# Altium schematic sheet LightLinkV2.SchDoc
size A4; SheetNumber: 1; SheetTotal: 4
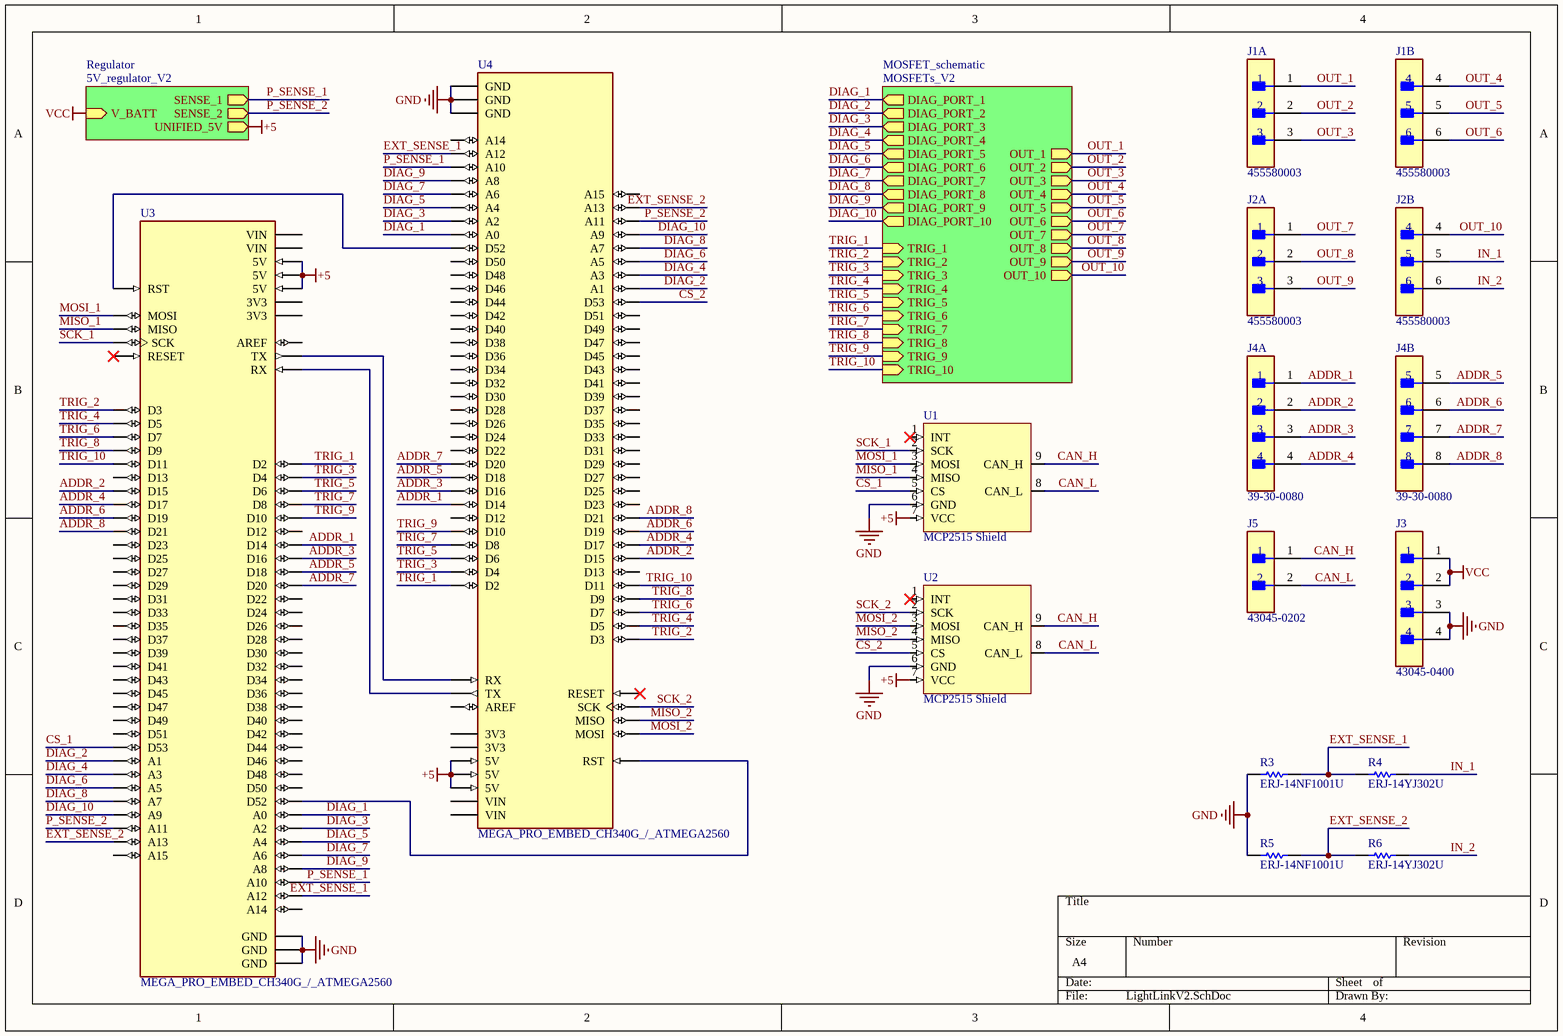
[diagram p0: LightLinkV2.SchDoc]

## Parts
J1  455580003  [FP-455580003-MFG]  (parts A,B of 2)
J2  455580003  [FP-455580003-MFG]  (parts A,B of 2)
J3  43045-0400  [FP-43045-0400-MFG]
J4  39-30-0080  [FP-39-30-0080-MFG]  (parts A,B of 2)
J5  43045-0202  [FP-43045-0202-MFG]
R3  ERJ-14NF1001U  [RESC3225X70X50NL20T20]
R4  ERJ-14YJ302U  [RESC3225X70X50NL20T20]
R5  ERJ-14NF1001U  [RESC3225X70X50NL20T20]
R6  ERJ-14YJ302U  [RESC3225X70X50NL20T20]
U1  MCP2515 Shield  [MCP2515 Shield-Footprint-1]
U2  MCP2515 Shield  [MCP2515 Shield-Footprint-1]
U3  MEGA_PRO_EMBED_CH340G_/_ATMEGA2560  [MODULE_MEGA_PRO_EMBED_CH340G_/_ATMEGA2560]
U4  MEGA_PRO_EMBED_CH340G_/_ATMEGA2560  [MODULE_MEGA_PRO_EMBED_CH340G_/_ATMEGA2560]

## Sub-sheets
MOSFET_schematic = MOSFETs_V2: DIAG_PORT_1 (out), TRIG_1 (in), DIAG_PORT_2 (out), TRIG_2 (in), DIAG_PORT_3 (out), TRIG_3 (in), DIAG_PORT_4 (out), TRIG_4 (in), OUT_4 (out), OUT_3 (out), OUT_2 (out), OUT_1 (out), DIAG_PORT_5 (out), TRIG_5 (in), DIAG_PORT_6 (out), TRIG_6 (in), DIAG_PORT_7 (out), TRIG_7 (in), DIAG_PORT_8 (out), TRIG_8 (in), OUT_8 (out), OUT_7 (out), OUT_6 (out), OUT_5 (out), DIAG_PORT_9 (out), TRIG_9 (in), OUT_9 (out), DIAG_PORT_10 (out), TRIG_10 (in), OUT_10 (out)
Regulator = 5V_regulator_V2: UNIFIED_5V (out), V_BATT (in), SENSE_1 (out), SENSE_2 (out)

## Nets
+5: U1.7(VCC) U2.7(VCC) U3.5V_1(5V) U3.5V_2(5V) U3.5V_3(5V) U4.5V_1(5V) U4.5V_2(5V) U4.5V_3(5V) ; sheet Regulator/UNIFIED_5V
GND: J3.3 J3.4 R3.1 R5.1 U1.6(GND) U2.6(GND) U3.GND_1(GND) U3.GND_2(GND) U3.GND_3(GND) U4.GND_1(GND) U4.GND_2(GND) U4.GND_3(GND)
VCC: J3.1 J3.2 ; sheet Regulator/V_BATT
ADDR_1: J4.1 U3.D14 U4.D14
ADDR_2: J4.2 U3.D15 U4.D15
ADDR_3: J4.3 U3.D16 U4.D16
ADDR_4: J4.4 U3.D17 U4.D17
ADDR_5: J4.5 U3.D18 U4.D18
ADDR_6: J4.6 U3.D19 U4.D19
ADDR_7: J4.7 U3.D20 U4.D20
ADDR_8: J4.8 U3.D21 U4.D21
CAN_H: J5.1 U1.9(CAN_H) U2.9(CAN_H)
CAN_L: J5.2 U1.8(CAN_L) U2.8(CAN_L)
CS_1: U1.5(CS) U3.D53
CS_2: U2.5(CS) U4.D53
DIAG_1: U3.A0 U4.A0 ; sheet MOSFET_schematic/DIAG_PORT_1
DIAG_2: U3.A1 U4.A1 ; sheet MOSFET_schematic/DIAG_PORT_2
DIAG_3: U3.A2 U4.A2 ; sheet MOSFET_schematic/DIAG_PORT_3
DIAG_4: U3.A3 U4.A3 ; sheet MOSFET_schematic/DIAG_PORT_4
DIAG_5: U3.A4 U4.A4 ; sheet MOSFET_schematic/DIAG_PORT_5
DIAG_6: U3.A5 U4.A5 ; sheet MOSFET_schematic/DIAG_PORT_6
DIAG_7: U3.A6 U4.A6 ; sheet MOSFET_schematic/DIAG_PORT_7
DIAG_8: U3.A7 U4.A7 ; sheet MOSFET_schematic/DIAG_PORT_8
DIAG_9: U3.A8 U4.A8 ; sheet MOSFET_schematic/DIAG_PORT_9
DIAG_10: U3.A9 U4.A9 ; sheet MOSFET_schematic/DIAG_PORT_10
EXT_SENSE_1: R3.2 R4.1 U3.A12 U4.A12
EXT_SENSE_2: R5.2 R6.1 U3.A13 U4.A13
IN_1: J2.5 R4.2
IN_2: J2.6 R6.2
MISO_1: U1.4(MISO) U3.MISO
MISO_2: U2.4(MISO) U4.MISO
MOSI_1: U1.3(MOSI) U3.MOSI
MOSI_2: U2.3(MOSI) U4.MOSI
OUT_1: J1.1 ; sheet MOSFET_schematic/OUT_1
OUT_2: J1.2 ; sheet MOSFET_schematic/OUT_2
OUT_3: J1.3 ; sheet MOSFET_schematic/OUT_3
OUT_4: J1.4 ; sheet MOSFET_schematic/OUT_4
OUT_5: J1.5 ; sheet MOSFET_schematic/OUT_5
OUT_6: J1.6 ; sheet MOSFET_schematic/OUT_6
OUT_7: J2.1 ; sheet MOSFET_schematic/OUT_7
OUT_8: J2.2 ; sheet MOSFET_schematic/OUT_8
OUT_9: J2.3 ; sheet MOSFET_schematic/OUT_9
OUT_10: J2.4 ; sheet MOSFET_schematic/OUT_10
P_SENSE_1: U3.A10 U4.A10 ; sheet Regulator/SENSE_1
P_SENSE_2: U3.A11 U4.A11 ; sheet Regulator/SENSE_2
SCK_1: U1.2(SCK) U3.SCK
SCK_2: U2.2(SCK) U4.SCK
TRIG_1: U3.D2 U4.D2 ; sheet MOSFET_schematic/TRIG_1
TRIG_2: U3.D3 U4.D3 ; sheet MOSFET_schematic/TRIG_2
TRIG_3: U3.D4 U4.D4 ; sheet MOSFET_schematic/TRIG_3
TRIG_4: U3.D5 U4.D5 ; sheet MOSFET_schematic/TRIG_4
TRIG_5: U3.D6 U4.D6 ; sheet MOSFET_schematic/TRIG_5
TRIG_6: U3.D7 U4.D7 ; sheet MOSFET_schematic/TRIG_6
TRIG_7: U3.D8 U4.D8 ; sheet MOSFET_schematic/TRIG_7
TRIG_8: U3.D9 U4.D9 ; sheet MOSFET_schematic/TRIG_8
TRIG_9: U3.D10 U4.D10 ; sheet MOSFET_schematic/TRIG_9
TRIG_10: U3.D11 U4.D11 ; sheet MOSFET_schematic/TRIG_10
NetU3_D52: U3.D52 U4.RST
NetU3_RST: U3.RST U4.D52
NetU3_RX: U3.RX U4.TX
NetU3_TX: U3.TX U4.RX

Not connected (* = marked no-connect by the designer): U1 1(INT)*; U2 1(INT)*; U3 3V3_1(3V3) 3V3_2(3V3) A14 A15 AREF D12 D13 D22 D23 D24 D25 D26 D27 D28 D29 D30 D31 D32 D33 D34 D35 D36 D37 D38 D39 D40 D41 D42 D43 D44 D45 D46 D47 D48 D49 D50 D51 RESET* VIN_1(VIN) VIN_2(VIN); U4 3V3_1(3V3) 3V3_2(3V3) A14 A15 AREF D12 D13 D22 D23 D24 D25 D26 D27 D28 D29 D30 D31 D32 D33 D34 D35 D36 D37 D38 D39 D40 D41 D42 D43 D44 D45 D46 D47 D48 D49 D50 D51 RESET* VIN_1(VIN) VIN_2(VIN)

## Library data of the parts
J1 J2 = CMP-04776-000024-1: CONN HEADER R/A 6POS 4.2MM; Manufacturer: Molex; Standoff Height: 0.4mm; Conn Orientation: Right Angle; Description: Connector Header Through Hole, Right Angle 6 position 0.165" (4.20mm); Number Of Contacts: 6; Conn Gender: Male; Voltage Rating: 600V; Current Rating: 8A; Footprint Url: https://www.molex.com/pdm_docs/sd/455580003_sd.pdf; Number Of Rows: 2; Lead Free: Yes; Digikey Description: CONN HEADER R/A 6POS 4.2MM; ComponentLink2URL: https://www.molex.com/webdocs/datasheets/pdf/en-us/0455580003_PCB_HEADERS.pdf; Octopart: https://octopart.com/45558-0003-molex-7672845; Package: 0; Device Class L3: unset; ComponentLink2Description: Datasheet; Device Class L2: Headers and Wire Housings; Category: Conn; Contact Material: Tin,Nickel; Mouser Description: Conn Power HDR 6 POS 4.2mm Solder ST Thru-Hole 6 Terminal 1 Port Mini-Fit Jr™ Tray; Manufacturer Part Number: 455580003; Pitch: 4.2mm; Device Class L1: Connectors; Temperature Range Low: -40°C; Temperature: -40°C to +105°C; RoHS: TRUE; Temperature Range High: +105°C; Height: 10.38mm; Automotive: No
J3 = CMP-04776-000002-1: CONN HEADER R/A 4POS 3MM; Manufacturer: Molex; Conn Gender: Male; Conn Orientation: Right Angle; Voltage Rating: 600V; Number Of Contacts: 4; Is Female: yes; Current Rating: 8.5A; ComponentLink2URL: https://www.molex.com/webdocs/datasheets/pdf/en-us/0430450400_PCB_HEADERS.pdf; Manufacturer Part Number: 43045-0400; Digikey Description: CONN HEADER R/A 4POS 3MM; Category: Conn; Temperature Range High: +105°C; Lead Free: Yes; Device Class L1: Connectors; Automotive: No; Temperature: -40°C to +105°C; Footprint Url: https://www.molex.com/pdm_docs/sd/430450400_sd.pdf; Height: 9.27mm; Number Of Rows: 2; Device Class L3: unset; Pitch: 3mm; Temperature Range Low: -40°C; Contact Material: Tin,Nickel; Octopart: https://octopart.com/43045-0400-molex-287063; RoHS: TRUE; ComponentLink2Description: Datasheet; Package: 43045-0400; Device Class L2: Headers and Wire Housings
J4 = CMP-04776-000387-1: CONN HEADER R/A 8POS 4.2MM; Number of Contacts: 8; Max Voltage Rating (AC): 600V; Insulation Resistance: 1GR; Contact Resistance: 10mR; Max Current Rating: 7A; Gender: Male; Row Spacing: 0.165inch; Approvals: UL; Number of Ports: 1; Current Rating: 13A; Glow Wire Compliant: Non-compliant; Pitch: 4.2mm; Housing Material: Nylon; Color: Natural; Max Operating Temperature: 105°C; Packaging: Bag; Termination: Solder; Flammability Rating: UL94 V-0; Width: 11.4mm; Contact Plating: Tin; Material: Nylon; Mount: Through Hole; Height: 11.4mm; Halogen Free: Low Halogen; Depth: 19.4mm; ELV: Compliant; Number of Terminals/Pins: 8; Orientation: Right Angle; Number of Positions: 8; Contact Material: Brass; Number of Rows: 2; Lead Free: Lead Free; Contact Type: Male Pin; Min Operating Temperature: -40°C; Fastening Type: Ramp; Package Quantity: 225; Voltage Rating (DC): 600V; Number of Circuits: 8; Housing Color: Natural; Voltage Rating: 600V; Series: Mini-Fit® Jr™ 5569; Contact Gender: Male; Length: 18mm
J5 = CMP-04776-000660-1: CONN HEADER R/A 2POS; Number of Contacts: 2; Current Rating: 5A; Gender: Male; Contact Resistance: 10mR; Voltage Rating (DC): 250V; Glow Wire Compliant: Compliant; Voltage Rating: 600V; Pitch: 3mm; Max Voltage Rating (DC): 250.25kV; Insulation Resistance: 1GR; Radiation Hardening: No; Halogen Free: Low Halogen; Number of Positions: 2; Mount: Through Hole; RoHS Compliant: Yes; Lead Free: Contains Lead; Color: Black; Max Current Rating: 5A; Length: 7.15mm; Orientation: Right Angle; Termination: Solder; Height: 8.77mm; Flammability Rating: UL94 V-0; Diameter: 3mm; Min Operating Temperature: -40°C; Series: Micro-Fit 3.0; Max Operating Temperature: 105°C; Number of Circuits: 2; Number of Rows: 2; Depth: 12.2mm; Housing Color: Black; Contact Plating: Gold; Case/Package: SMC; Contact Material: Brass; Packaging: Tray; Housing Material: Thermoplastic; Package Quantity: 3168
R3 R5 = CMP-2005-01957-1: Manufacturer: Panasonic; Part Number: ERJ-14NF1001U
R4 R6 = CMP-2005-03553-1: Manufacturer: Panasonic; Part Number: ERJ-14YJ302U
U1 U2 = CMP-015-00008-2: PCB layout of Arduino MCP2515 shield to avoid remaking the schematic and ordering individual components when I already have a dozen shields on hand.
U3 U4 = CMP-002-000002-2: Mega 2560 PRO (Embed) CH340G/ATmega2560-16AU; Component Type: Standard; Design Item ID: MEGA_PRO_EMBED_CH340G_/_ATMEGA2560; Price: None; Pin Count: 86; Source: MEGA_PRO_EMBED_CH340G___ATMEGA2560.SchLib; Value: *; Availability: Unavailable; MP: MEGA_PRO_EMBED_CH340G_/_ATMEGA2560; Package: None